# Altium schematic sheet PF6_FilterMode.SchDoc
size 127 x 127 mm
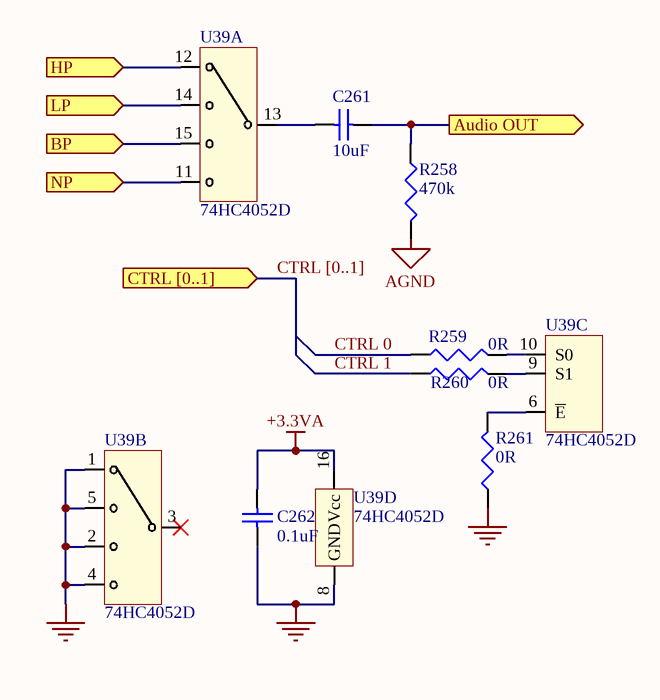
[diagram p0: PF6_FilterMode.SchDoc]

## Parts
C261  10uF  [CAPC1608X08]
C262  0.1uF  [CAPC1608X08]
R258  470k  [RESC1608X05]
R259  0R  [RESC1608X05]
R260  0R  [RESC1608X05]
R261  0R  [RESC1608X05]
U39  74HC4052D  [SOT109-1-M]  (parts A,B,C,D of 4)

## Ports
Audio OUT (out), BP (in), CTRL [0..1] (in), HP (in), LP (in), NP (in)

## Nets
+3.3VA: C262.1 U39.16(Vcc)
AGND: R258.2
GND: C262.2 R261.1 U39.1(2Y0) U39.2(2Y2) U39.4(2Y3) U39.5(2Y1) U39.8(GND)
Audio OUT: C261.1 R258.1 ; port Audio OUT
BP: U39.15(1Y2) ; port BP
CTRL 0: R259.1
CTRL 1: R260.1
HP: U39.12(1Y0) ; port HP
LP: U39.14(1Y1) ; port LP
NP: U39.11(1Y3) ; port NP
NetC261_2: C261.2 U39.13(1Z)
NetR259_2: R259.2 U39.10(S0)
NetR260_2: R260.2 U39.9(S1)
NetR261_2: R261.2 U39.6(~{E})

Not connected (* = marked no-connect by the designer): U39 3(2Z)*

## Buses and harness runs
bus CTRL [0..1] = port CTRL [0..1]

## Library data of the parts
C261 = Cap Semi: Capacitor (Semiconductor SIM Model); Fabricant: MURATA; Fournisseur: Farnell; RefFabricant: GRM188R60J106ME47J; RefFournisseur: 2611921; Value: 10uF; Case: 0603 [1608 Metric]; DataSheet: http://www.farnell.com/datasheets/2079165.pdf
C262 = Cap Semi: Capacitor (Semiconductor SIM Model); Fabricant: MURATA; Fournisseur: Farnell; RefFabricant: GRM188F51E104ZA01D; RefFournisseur: 2821272; Value: 0.1uF; Case: 0603 [1608 Metric]; DataSheet: http://www.farnell.com/datasheets/2048672.pdf
R258 = Res3: Resistor; Fabricant: TE CONNECTIVITY; Fournisseur: Farnell; RefFabricant: CPF0603B470KE1; RefFournisseur: 2331232; Value: 470k; Case: 0603 [1608 Metric]; DataSheet: http://www.farnell.com/datasheets/2043335.pdf
R259-R261 = Res3: Resistor; Value: 0; Case: 0603 [1608 Metric]
U39 = 74HC4052D: Dual 4:1 Multiplexer; RefFournisseur: 1201328; Fabricant: NEXPERIA; Fournisseur: Farnell; RefFabricant: 74HC4052D; DataSheet: http://www.farnell.com/datasheets/2051461.pdf